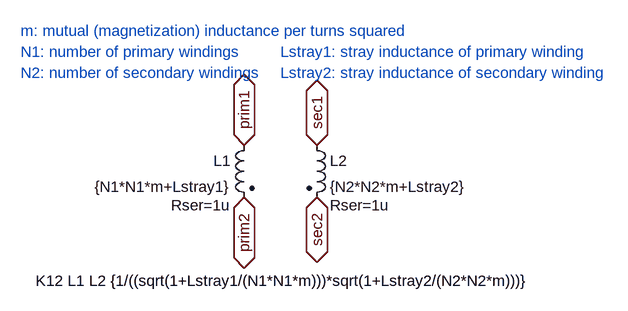
[diagram p0: schematic xformer_with_strays.asc]
xformer_with_strays.asc, the LTspice schematic file:
Version 4
SHEET 1 880 680
FLAG 144 112 prim1
IOPIN 144 112 BiDir
FLAG 256 112 sec1
IOPIN 256 112 BiDir
FLAG 144 192 prim2
IOPIN 144 192 BiDir
FLAG 256 192 sec2
IOPIN 256 192 BiDir
SYMBOL ind2 160 96 M0
WINDOW 39 36 108 Left 0
SYMATTR SpiceLine Rser=1u
SYMATTR InstName L1
SYMATTR Value {N1*N1*m+Lstray1}
SYMATTR Type ind
SYMBOL ind2 240 96 R0
WINDOW 39 36 108 Left 0
SYMATTR SpiceLine Rser=1u
SYMATTR InstName L2
SYMATTR Value {N2*N2*m+Lstray2}
SYMATTR Type ind
TEXT 208 320 Center 0 !K12 L1 L2 {1/((sqrt(1+Lstray1/(N1*N1*m)))*sqrt(1+Lstray2/(N2*N2*m)))}
TEXT -200 -32 Left 0 ;N1: number of primary windings
TEXT -200 0 Left 0 ;N2: number of secondary windings
TEXT 200 -32 Left 0 ;Lstray1: stray inductance of primary winding
TEXT 200 0 Left 0 ;Lstray2: stray inductance of secondary winding
TEXT -200 -64 Left 0 ;m: mutual (magnetization) inductance per turns squared

The netlist it stands for:
* xformer_with_strays.asc
L1 prim1 prim2 {N1*N1*m+Lstray1} Rser=1u
L2 sec1 sec2 {N2*N2*m+Lstray2} Rser=1u
K12 L1 L2 {1/((sqrt(1+Lstray1/(N1*N1*m)))*sqrt(1+Lstray2/(N2*N2*m)))}
* N1: number of primary windings
* N2: number of secondary windings
* Lstray1: stray inductance of primary winding
* Lstray2: stray inductance of secondary winding
* m: mutual (magnetization) inductance per turns squared
.backanno
.end